# Altium schematic sheet 9-SIGNAL_CONDITIONING.SchDoc: SIGNAL CONDITOINING
size A4; Author: Alexandre Cosneau; CompanyName: Tristar Multicopters; DrawnBy: Alexandre Cosneau; Engineer: Alexandre Cosneau; Organization: Tristar Multicopters; Address1: Genie / GEGI; Address2: 2500 boulevard de l'universite; Address3: J1K2R SHERBROOKE; Address4: QUEBEC, CANADA; DocumentNumber: 15; Revision: 1.0; SheetNumber: 15; SheetTotal: 15
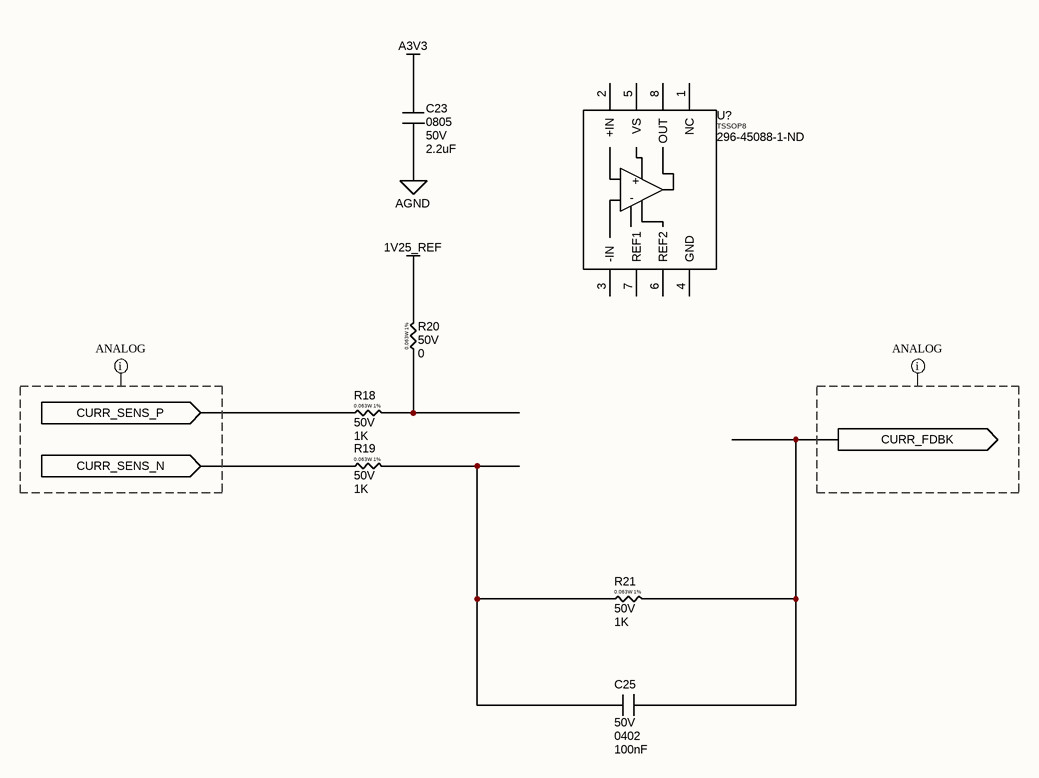
[diagram p0: 9-SIGNAL_CONDITIONING.SchDoc]

## Parts
C23  Package: 0805  VDC: 50V  [C 0805(2012)x0.65]  (hidden comment: 2.2uF)
C25  VDC: 50V  Package: 0402  [C 0402(1005)x0.5]  (hidden comment: 100nF)
R18  VDC: 50V  [R 0402(1005)-1%]  (hidden comment: 1K)
R19  VDC: 50V  [R 0402(1005)-1%]  (hidden comment: 1K)
R20  VDC: 50V  [R 0402(1005)-1%]  (hidden comment: 0)
R21  VDC: 50V  [R 0402(1005)-1%]  (hidden comment: 1K)
U?  TSSOP8  Supplier Part Number 1: 296-45088-1-ND  [TSSOP_8_4.4]

## Ports
CURR_FDBK (out), CURR_SENS_N (in), CURR_SENS_P (in)

## Nets
1V25_REF: R20.2
A3V3: C23.1
AGND: C23.2
CURR_FDBK: C25.2 R21.2 ; port CURR_FDBK
CURR_SENS_N: R19.1 ; port CURR_SENS_N
CURR_SENS_P: R18.1 ; port CURR_SENS_P
NetC25_1: C25.1 R19.2 R21.1
NetR18_2: R18.2 R20.1

Not connected (* = marked no-connect by the designer): U? 1(NC) 2(+IN) 3(-IN) 4(GND) 5(VS) 6(REF2) 7(REF1) 8(OUT)

## Layout directives
net class ANALOG: (no net found under the mark)

## Notes on the sheet
- Title:
- Size:
- Date:
- E
- Revision:
- Time:
- Author:
- Sheet
- of
- File:
- (in symbol INA240-Q1) +; -
- (in symbol RES 0402-1%) 0.063W 1%

## Library data of the parts
C23 = CAP 0805 2.2nF 50V X7R: SMD-0805 50V X7R 10%; Part Number: CL21B222KBNC; Manufacturer: Samsung; TYPE: Capacitors; Package-mm: 2012; Mount Type: SMT; Publisher: Hefest; Manufacturer Alternate: *; Part Number Alternate: *; Published: 07.04.2019; Supplier 1: Comet; Supplier 2: *; Supplier 3: *; Supplier Part Number 1: C0805 2.2nF 50V X7R SAMSUNG; Supplier Part Number 2: *; Supplier Part Number 3: *; RoHS: Y; Technology: Ceramic  MLCC; Value 1: *; Value 2: *; TempCo: X7R; Tolerance %: ±10%; VAC: *; ESR Ohm: *; ComponentLink1Description: Datasheet link; ComponentLink1URL: https://store.comet.bg/download-file.php?id=11; Temperature Range: -55°C ~ +125°C; Price: 0.026; Value: 2.2uF
C25 = CAP 0402 100nF 50V X7R: SMD-0402 100nF 50V X7R 10%; Part Number: CL05B104KB5NNNC; Manufacturer: Samsung; TYPE: Capacitors; Package-mm: 1005; Mount Type: SMT; Publisher: Hefest; Manufacturer Alternate: *; Part Number Alternate: *; Published: 07.04.2019; Supplier 1: Comet; Supplier 2: *; Supplier 3: *; Supplier Part Number 1: C0402 100nF 50V X7R; Supplier Part Number 2: *; Supplier Part Number 3: *; RoHS: Y; Technology: Ceramic  MLCC; Value 1: *; Value 2: *; TempCo: X7R; Tolerance %: ±10%; VAC: *; ESR Ohm: *; ComponentLink1Description: Datasheet link; ComponentLink1URL: https://store.comet.bg/download-file.php?id=11; Temperature Range: -55°C ~ +125°C; Price: 0.039; Value: 100nF
R18-R21 = RES 0402-1%: SMD 0402 0.063W 1% 50V; Manufacturer: YAGEO; TempCo: ±100ppm/°C; Package-mm: 1005; Value Code: 1001; Power: 0.0625W; Part Number: *; Mount Type: SMT; Publisher: Hefest; Manufacturer Alternate: *; Published: 07.04.2019; Supplier 1: Comet; Supplier 2: *; Supplier 3: *; Supplier Part Number 1: R0402 1.0K 1% YAG/ASJ; Supplier Part Number 2: *; Supplier Part Number 3: *; RoHS: Y; Technology: Thick film; Value 2: *; Package: 0402; Tolerance %: ±1%; ComponentLink1Description: Datasheet link; ComponentLink1URL: https://store.comet.bg/download-file.php?id=1224; Temperature Range: -55°C ~ +155°C; Price: 0.015; Part Number Alternate: *; TYPE: Resistor; Value 1: *
  R18 R19 R21: Value: 1K
  R20: Value: 0
U? = INA240-Q1: Current-Sense Amp., Zero-Drift, Wide Common-Mode, PWM Rej.; Supplier 1: Digi-Key